# EAGLE schematic GND_STN (EAGLE 9.6.2)
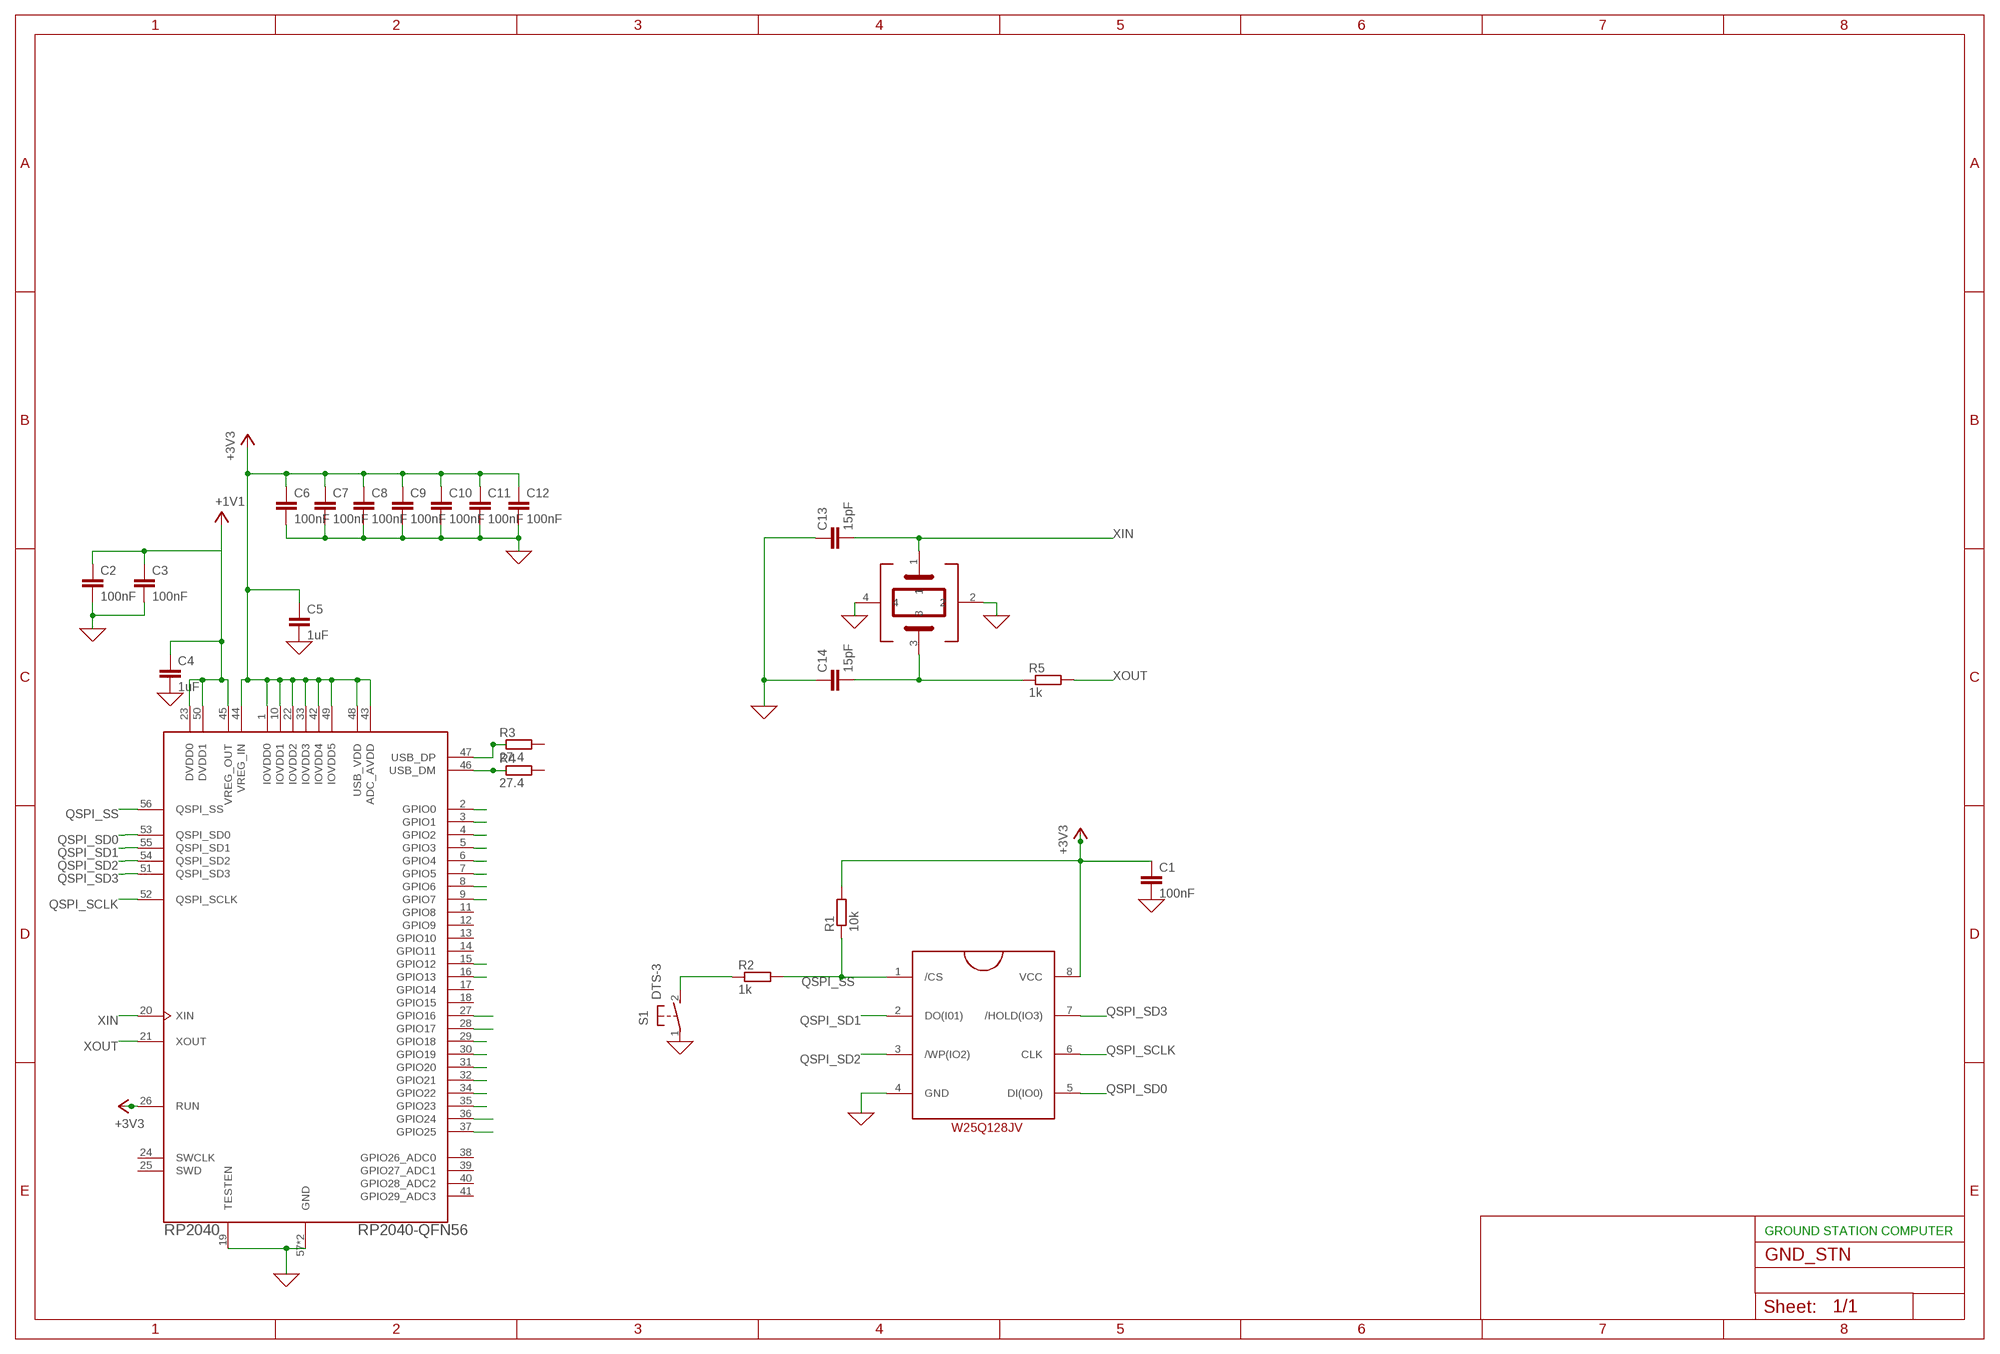
[diagram p0: schematic, sheet 1]

## Parts
C1  100nF  C-EUC0603  [C0603]
C2  100nF  C-EUC0603  [C0603]
C3  100nF  C-EUC0603  [C0603]
C4  1uF  C-EUC0603  [C0603]
C5  1uF  C-EUC0603  [C0603]
C6  100nF  C-EUC0603  [C0603]
C7  100nF  C-EUC0603  [C0603]
C8  100nF  C-EUC0603  [C0603]
C9  100nF  C-EUC0603  [C0603]
C10  100nF  C-EUC0603  [C0603]
C11  100nF  C-EUC0603  [C0603]
C12  100nF  C-EUC0603  [C0603]
C13  15pF  C-EUC0603  [C0603]
C14  15pF  C-EUC0603  [C0603]
R1  10k  R-EU_R0603  [R0603]
R2  1k  R-EU_R0603  [R0603]
R3  27.4  R-EU_R0603  [R0603]
R4  27.4  R-EU_R0603  [R0603]
R5  1k  R-EU_R0603  [R0603]
RP2040  RP2040-QFN56  [RP2040-QFN-56]
S1  DTS-3  [DTS-3]
U2  SOIC127P790X216-8NW25Q128JVJSQ  [SOIC127P790X216-8N]
U$1  ABM8-272-T3  [ABM8-272-T3]

## Nets
0: C1.2 C2.2 C3.2 C4.2 C5.2 C6.2 C7.2 C8.2 C9.2 C10.2 C11.2 C12.2 C13.1 C14.1 RP2040.19(TESTEN) RP2040.57(GND) RP2040.62(GND) S1.1 U2.4(GND) U$1.2 U$1.4 ; supply symbol labelled GND
1V1: C2.1 C3.1 C4.1 RP2040.23(DVDD0) RP2040.45(VREG_OUT) RP2040.50(DVDD1) ; supply symbol labelled +1V1
+3V3: C1.1 C5.1 C6.1 C7.1 C8.1 C9.1 C10.1 C11.1 C12.1 R1.2 RP2040.1(IOVDD0) RP2040.10(IOVDD1) RP2040.22(IOVDD2) RP2040.26(RUN) RP2040.33(IOVDD3) RP2040.42(IOVDD4) RP2040.43(ADC_AVDD) RP2040.44(VREG_IN) RP2040.48(USB_VDD) RP2040.49(IOVDD5) U2.8(VCC)
BUZZER: RP2040.2(GPIO0)
CAM: RP2040.4(GPIO2)
CTRL: RP2040.5(GPIO3)
DROGUE: RP2040.29(GPIO18)
FIN_1: RP2040.9(GPIO7)
FIN_2: RP2040.8(GPIO6)
FIN_3: RP2040.7(GPIO5)
FIN_4: RP2040.6(GPIO4)
GPS_RX: RP2040.27(GPIO16)
GPS_TX: RP2040.28(GPIO17)
IGN1: RP2040.31(GPIO20)
IGN2: RP2040.32(GPIO21)
LED: RP2040.3(GPIO1)
MAIN: RP2040.30(GPIO19)
N$1: C14.2 R5.1 U$1.3
N$2: R2.1 S1.2
N$3: R3.1 RP2040.47(USB_DP)
N$4: R4.1 RP2040.46(USB_DM)
QSPI_SCLK: RP2040.52(QSPI_SCLK) U2.6(CLK)
QSPI_SD0: RP2040.53(QSPI_SD0) U2.5(DI(IO0))
QSPI_SD1: RP2040.55(QSPI_SD1) U2.2(DO(I01))
QSPI_SD2: RP2040.54(QSPI_SD2) U2.3(/WP(IO2))
QSPI_SD3: RP2040.51(QSPI_SD3) U2.7(/HOLD(IO3))
QSPI_SS: R1.1 R2.2 RP2040.56(QSPI_SS) U2.1(/CS)
RSSI: RP2040.35(GPIO23)
SCL: RP2040.16(GPIO13)
SDA: RP2040.15(GPIO12)
TEL_RST: RP2040.34(GPIO22)
TEL_RX: RP2040.36(GPIO24)
TEL_TX: RP2040.37(GPIO25)
XIN: C13.2 RP2040.20(XIN) U$1.1
XOUT: R5.2 RP2040.21(XOUT)
Unconnected: R3.2 R4.2 RP2040.11(GPIO8) RP2040.12(GPIO9) RP2040.13(GPIO10) RP2040.14(GPIO11) RP2040.17(GPIO14) RP2040.18(GPIO15) RP2040.24(SWCLK) RP2040.25(SWD) RP2040.38(GPIO26_ADC0) RP2040.39(GPIO27_ADC1) RP2040.40(GPIO28_ADC2) RP2040.41(GPIO29_ADC3)

## Notes on the sheet
- GROUND STATION COMPUTER

## Library data of the parts
C1-C14 = rcl:C-EU: CAPACITOR, European symbol; SPICEPREFIX: C
R1-R5 = rcl:R-EU_: RESISTOR, European symbol; SPICEPREFIX: R
RP2040 = RpiPico:RP2040-QFN56
S1 = DTS-3:DTS-3: Check availability <https://pricing.snapeda.com/parts/DTS-3/APEM%20Inc./view-part?ref=eda>; AVAILABILITY: Not in stock; CHECK_PRICES: https://www.snapeda.com/parts/DTS-3/APEM/view-part/?ref=eda; DESCRIPTION: Tactile Switch SPST-NO Top Actuated Through Hole; MF: APEM Inc.; MP: DTS-3; PACKAGE: DIP-10 APEM Inc.; PRICE: None; SNAPEDA_LINK: https://www.snapeda.com/parts/DTS-3/APEM/view-part/?ref=snap
U2 = SOIC127P790X216-8N:SOIC127P790X216-8N
U$1 = ABM8-272-T3:ABM8-272-T3: Check availability <https://pricing.snapeda.com/parts/ABM8-272-T3/ABRACON/view-part?ref=eda>; AVAILABILITY: In Stock; CHECK_PRICES: https://www.snapeda.com/parts/ABM8-272-T3/Abracon/view-part/?ref=eda; DESCRIPTION: 12 MHz ±30ppm Crystal 10pF 50 Ohms 4-SMD, No Lead; MF: ABRACON; MP: ABM8-272-T3; PACKAGE: NON-STANDARD-4 Abracon; PRICE: None; SNAPEDA_LINK: https://www.snapeda.com/parts/ABM8-272-T3/Abracon/view-part/?ref=snap